# Altium schematic sheet MicroMultimeter_MAIN_Sch.SchDoc: MicroMultimeter
size 203 x 127 mm; Author: Hom; CompanyName: KitSprout; DrawnBy: Hom; Engineer: Hom; Organization: KitSprout; Revision: B; SheetNumber: 1; SheetTotal: 1; License: CC BY-SA 4.0; Version: 1.0; LibVersion: 1.4; PageSetup: Record=PageOptions|CenterHorizontal=True|CenterVertical=True|PrintScale=1.00|XCorrection=1.00|YCorrection=1.00|PrintKind=0|BorderSize=5000000|LeftOffset=0|BottomOffset=0|Orientation=2|PaperLength=1000|PaperWidth=1000|Scale=100|PaperSource=7|PrintQuality=-3|MediaType=1|DitherType=10|PrintScaleMode=0|PaperKind=A4|PaperIndex=9
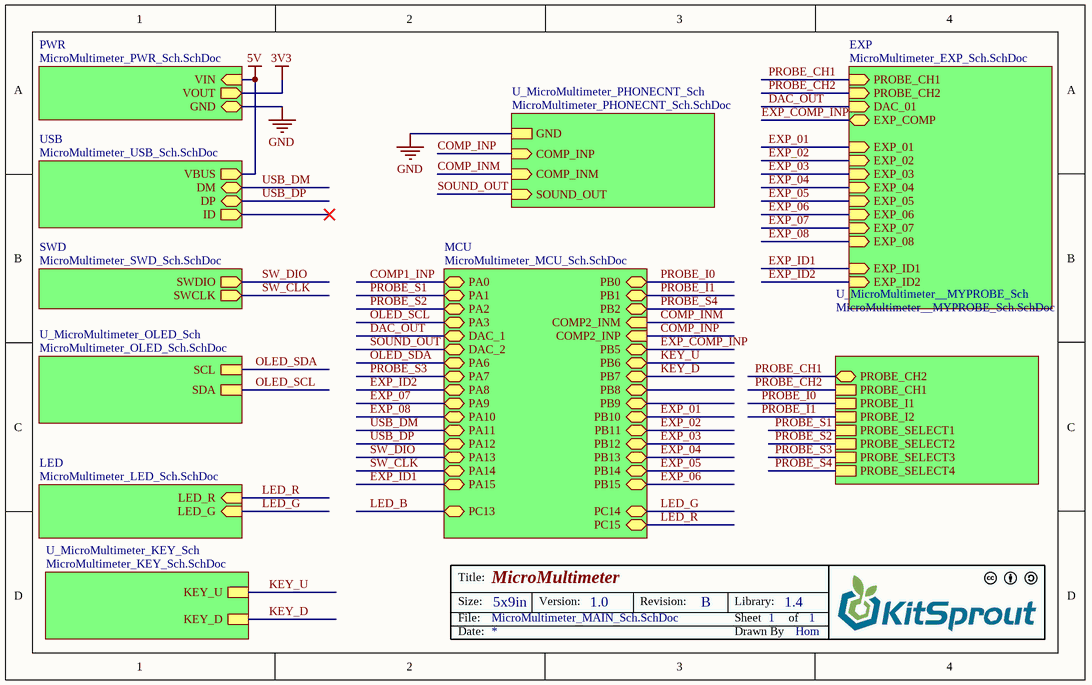
[diagram p0: MicroMultimeter_MAIN_Sch.SchDoc]

## Sub-sheets
EXP = MicroMultimeter_EXP_Sch.SchDoc: PROBE_CH1 (in), PROBE_CH2 (in), EXP_01 (in), EXP_02 (in), EXP_03 (in), EXP_04 (in), EXP_05 (in), EXP_06 (in), EXP_07 (in), EXP_08 (in), EXP_ID1 (in), EXP_ID2 (in), DAC_01 (in), EXP_COMP
LED = MicroMultimeter_LED_Sch.SchDoc: LED_G (in), LED_R (in)
MCU = MicroMultimeter_MCU_Sch.SchDoc: PA0, PA1, PA2, PA3, DAC_1, DAC_2, PA6, PA7, PA8, PA9, PA10, PA11, PA12, PA13, PA14, PA15, PB0, PB1, COMP2_INM (in), COMP2_INP (in), PB2, PB5, PB6, PB7, PB8, PB9, PB10, PB11, PB12, PB13, PB14, PB15, PC13, PC14, PC15
PWR = MicroMultimeter_PWR_Sch.SchDoc: VOUT (out), VIN (in), GND (bidir)
SWD = MicroMultimeter_SWD_Sch.SchDoc: SWDIO (out), SWCLK (out)
U_MicroMultimeter__MYPROBE_Sch = MicroMultimeter__MYPROBE_Sch.SchDoc: PROBE_I1, PROBE_CH2 (bidir), PROBE_CH1, PROBE_I2, PROBE_SELECT1, PROBE_SELECT2, PROBE_SELECT3, PROBE_SELECT4
U_MicroMultimeter_KEY_Sch = MicroMultimeter_KEY_Sch.SchDoc: KEY_U, KEY_D
U_MicroMultimeter_OLED_Sch = MicroMultimeter_OLED_Sch.SchDoc: SCL, SDA
U_MicroMultimeter_PHONECNT_Sch = MicroMultimeter_PHONECNT_Sch.SchDoc: GND, SOUND_OUT (in), COMP_INP (in), COMP_INM (in)
USB = MicroMultimeter_USB_Sch.SchDoc: DM (bidir), VBUS (out), DP (bidir), ID (out)

## Nets
3V3: sheet PWR/VOUT
5V: sheet PWR/VIN, sheet USB/VBUS
GND: sheet PWR/GND, sheet U_MicroMultimeter_PHONECNT_Sch/GND
COMP1_INP: sheet MCU/PA0
COMP_INM: sheet MCU/COMP2_INM, sheet U_MicroMultimeter_PHONECNT_Sch/COMP_INM
COMP_INP: sheet MCU/COMP2_INP, sheet U_MicroMultimeter_PHONECNT_Sch/COMP_INP
DAC_OUT: sheet EXP/DAC_01, sheet MCU/DAC_1
EXP_01: sheet EXP/EXP_01, sheet MCU/PB10
EXP_02: sheet EXP/EXP_02, sheet MCU/PB11
EXP_03: sheet EXP/EXP_03, sheet MCU/PB12
EXP_04: sheet EXP/EXP_04, sheet MCU/PB13
EXP_05: sheet EXP/EXP_05, sheet MCU/PB14
EXP_06: sheet EXP/EXP_06, sheet MCU/PB15
EXP_07: sheet EXP/EXP_07, sheet MCU/PA9
EXP_08: sheet EXP/EXP_08, sheet MCU/PA10
EXP_COMP_INP: sheet EXP/EXP_COMP, sheet MCU/PB5
EXP_ID1: sheet EXP/EXP_ID1, sheet MCU/PA15
EXP_ID2: sheet EXP/EXP_ID2, sheet MCU/PA8
KEY_D: sheet MCU/PB7, sheet U_MicroMultimeter_KEY_Sch/KEY_D
KEY_U: sheet MCU/PB6, sheet U_MicroMultimeter_KEY_Sch/KEY_U
LED_B: sheet MCU/PC13
LED_G: sheet LED/LED_G, sheet MCU/PC14
LED_R: sheet LED/LED_R, sheet MCU/PC15
OLED_SCL: sheet MCU/PA3, sheet U_MicroMultimeter_OLED_Sch/SDA
OLED_SDA: sheet MCU/PA6, sheet U_MicroMultimeter_OLED_Sch/SCL
PROBE_CH1: sheet EXP/PROBE_CH1, sheet U_MicroMultimeter__MYPROBE_Sch/PROBE_CH2
PROBE_CH2: sheet EXP/PROBE_CH2, sheet U_MicroMultimeter__MYPROBE_Sch/PROBE_CH1
PROBE_I0: sheet MCU/PB0, sheet U_MicroMultimeter__MYPROBE_Sch/PROBE_I1
PROBE_I1: sheet MCU/PB1, sheet U_MicroMultimeter__MYPROBE_Sch/PROBE_I2
PROBE_S1: sheet MCU/PA1, sheet U_MicroMultimeter__MYPROBE_Sch/PROBE_SELECT1
PROBE_S2: sheet MCU/PA2, sheet U_MicroMultimeter__MYPROBE_Sch/PROBE_SELECT2
PROBE_S3: sheet MCU/PA7, sheet U_MicroMultimeter__MYPROBE_Sch/PROBE_SELECT3
PROBE_S4: sheet MCU/PB2, sheet U_MicroMultimeter__MYPROBE_Sch/PROBE_SELECT4
SOUND_OUT: sheet MCU/DAC_2, sheet U_MicroMultimeter_PHONECNT_Sch/SOUND_OUT
SW_CLK: sheet SWD/SWCLK, sheet MCU/PA14
SW_DIO: sheet SWD/SWDIO, sheet MCU/PA13
USB_DM: sheet USB/DM, sheet MCU/PA11
USB_DP: sheet USB/DP, sheet MCU/PA12

## Notes on the sheet
- Title:
- Size:
- Date:
- File:
- 5x9in
- Version:
- Revision:
- Sheet
- Drawn By
- Library:
- of